# Altium schematic sheet POWER_TREE.SchDoc
size 420 x 297 mm; SheetNumber: 4; SheetTotal: 24
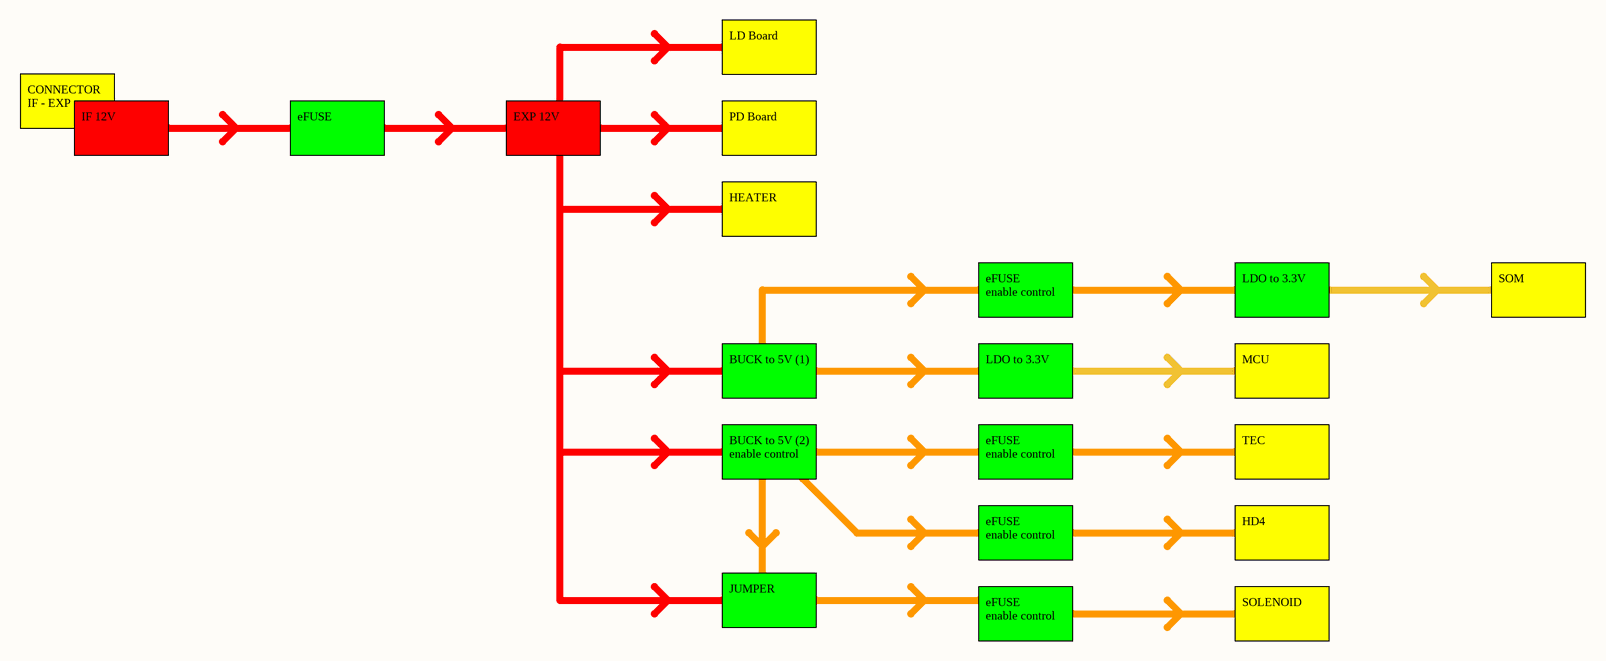
[diagram p0: POWER_TREE.SchDoc]

## Notes on the sheet
- LD Board
- CONNECTOR
  IF - EXP
- IF 12V
- eFUSE
- EXP 12V
- PD Board
- HEATER
- eFUSE
  enable control
- LDO to 3.3V
- SOM
- BUCK to 5V (1)
- MCU
- BUCK to 5V (2)
  enable control
- TEC
- HD4
- JUMPER
- SOLENOID
- Project:
- BEE-PC1
- Sub-system:
- NANORACK_EXP_CONTROLLER
- Design by:
- SANG HUYNH
- BAO BUI Q.
- Sheet title:
- Sheet
- A3
- of
- Checked by:
- Approved by:
- VU PHAM
- Revision:
- Document No:
- V1.2.2
- Size:
- Date: